# EAGLE design Hardwin01 (EAGLE 7.7.0)
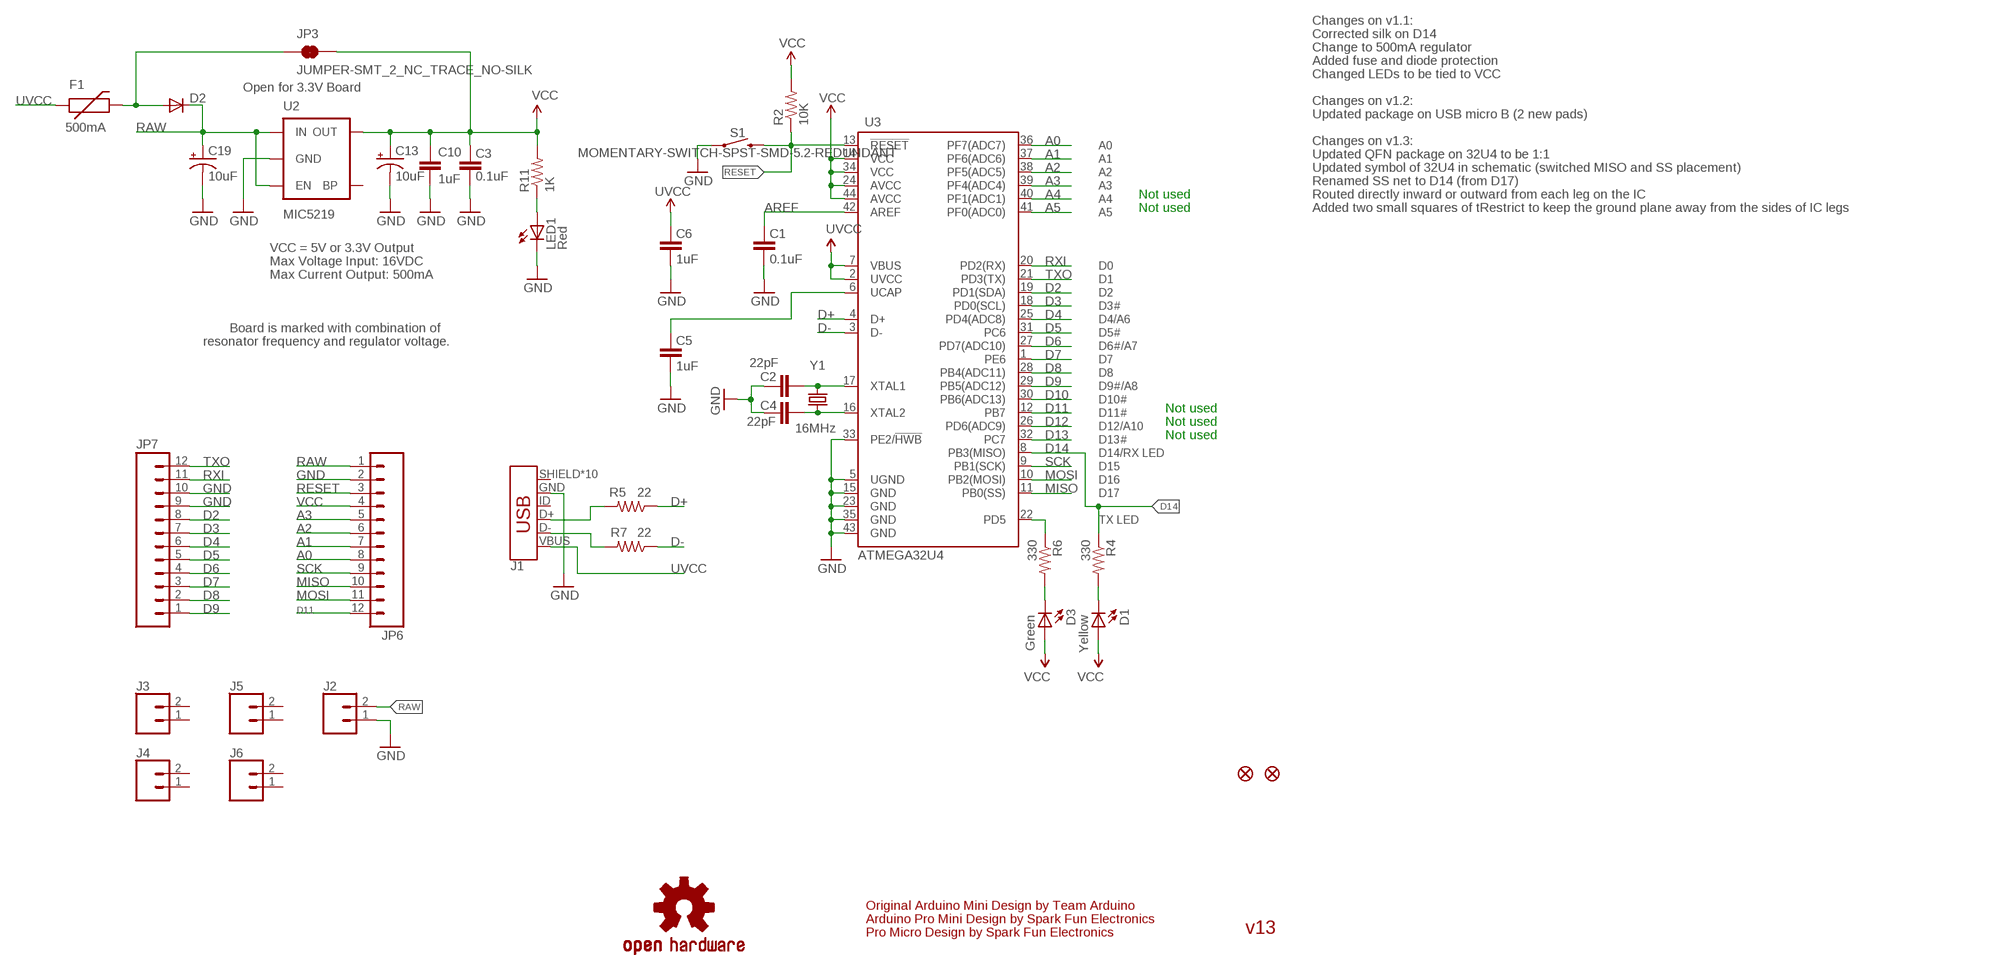
[diagram p0: schematic, sheet 1]

## Parts
C1  0.1uF  CAP0603-CAP  [0603-CAP]
C2  22pF  CAP0603-CAP  [0603-CAP]
C3  0.1uF  CAP0603-CAP  [0603-CAP]
C4  22pF  CAP0603-CAP  [0603-CAP]
C5  1uF  CAP0603-CAP  [0603-CAP]
C6  1uF  CAP0603-CAP  [0603-CAP]
C10  1uF  CAP0603-CAP  [0603-CAP]
C13  10uF  CAP_POL1206  [EIA3216]
C19  10uF  CAP_POL1206  [EIA3216]
D1  Yellow  LED0603  [LED-0603]
D2  DIODESOD  [SOD-323]
D3  Green  LED0603  [LED-0603]
F1  500mA  PTCSMD  [PTC-1206]
J1  USB_MICRO-B_HALF_PTH_MILL  [USB-MICROB-PTH-MILL]
J2  CONN_02PTH3  [1X02_LONGPADS]
J3  CONN_02  [1X02]
J4  CONN_02  [1X02]
J5  CONN_02  [1X02]
J6  CONN_02  [1X02]
JP1  FIDUCIALUFIDUCIAL  [MICRO-FIDUCIAL]
JP2  FIDUCIALUFIDUCIAL  [MICRO-FIDUCIAL]
JP3  JUMPER-SMT_2_NC_TRACE_NO-SILK  [SMT-JUMPER_2_NC_TRACE_NO-SILK]
JP6  M12PTH  [1X12]
JP7  M12PTH  [1X12]
LED1  Red  LED0603  [LED-0603]
R2  10K  RESISTOR0603-RES  [0603-RES]
R4  330  RESISTOR0603-RES  [0603-RES]
R5  22  RESISTOR0603-RES  [0603-RES]
R6  330  RESISTOR0603-RES  [0603-RES]
R7  22  RESISTOR0603-RES  [0603-RES]
R11  1K  RESISTOR0603-RES  [0603-RES]
S1  MOMENTARY-SWITCH-SPST-SMD-5.2-REDUNDANT  [TACTILE_SWITCH_SMD_5.2MM]
U2  MIC5219  V_REG_LDOSMD  [SOT23-5]
U3  ATMEGA32U4  ATMEGA32U4OUTFAKES  [QFN-44-NOPAD_1:1-OUTFAKES]
U$3  OSHW-LOGOS  [OSHW-LOGO-S]
Y1  16MHz  CRYSTAL5X3  [CRYSTAL-SMD-5X3]

## Nets
A0: JP6.8 U3.36(PF7(ADC7))
A1: JP6.7 U3.37(PF6(ADC6))
A2: JP6.6 U3.38(PF5(ADC5))
A3: JP6.5 U3.39(PF4(ADC4))
A4: U3.40(PF1(ADC1))
A5: U3.41(PF0(ADC0))
AREF: C1.2 U3.42(AREF)
D2: JP7.8 U3.19(PD1(SDA))
D3: JP7.7 U3.18(PD0(SCL))
D4: JP7.6 U3.25(PD4(ADC8))
D5: JP7.5 U3.31(PC6)
D6: JP7.4 U3.27(PD7(ADC10))
D7: JP7.3 U3.1(PE6)
D8: JP7.2 U3.28(PB4(ADC11))
D9: JP7.1 U3.29(PB5(ADC12))
D10: U3.30(PB6(ADC13))
D11: JP6.12 U3.12(PB7)
D12: U3.26(PD6(ADC9))
D13: U3.32(PC7)
D14: R4.1 U3.8(PB3(MISO))
D+: R5.1 U3.4(D+)
D-: R7.1 U3.3(D-)
GND [vcc]: C1.1 C2.2 C3.1 C4.2 C5.1 C6.1 C10.2 C13.C(-) C19.C(-) J1.GND J2.1 JP6.2 JP7.9 JP7.10 LED1.C S1.1 S1.2 U2.2(GND) U3.5(UGND) U3.15(GND) U3.23(GND) U3.33(PE2/!HWB) U3.35(GND) U3.43(GND)
MISO: JP6.10 U3.11(PB0(SS))
MOSI: JP6.11 U3.10(PB2(MOSI))
N$1: C4.1 U3.16(XTAL2) Y1.1
N$2: C2.1 U3.17(XTAL1) Y1.3
N$3: D2.2(A) F1.2 JP3.1
N$4: C5.2 U3.6(UCAP)
N$5: D1.C R4.2
N$6: J1.D- R7.2
N$7: D3.C R6.2
N$8: J1.D+ R5.2
N$38: LED1.A R11.1
RAW [vcc]: C19.A(+) D2.1(C) J2.2 JP6.1 U2.1(IN) U2.3(EN)
RESET: JP6.3 R2.1 S1.3 S1.4 U3.13(!RESET)
RXI: JP7.11 U3.20(PD2(RX))
SCK: JP6.9 U3.9(PB1(SCK))
TXLED: R6.1 U3.22(PD5)
TXO: JP7.12 U3.21(PD3(TX))
UVCC: C6.2 F1.1 J1.VBUS U3.2(UVCC) U3.7(VBUS)
VCC: C3.2 C10.1 C13.A(+) D1.A D3.A JP3.2 JP6.4 R2.2 R11.2 U2.5(OUT) U3.14(VCC) U3.24(AVCC) U3.34(VCC) U3.44(AVCC)
Unconnected: J1.ID J1.SHIELD J1.SHIELD2(SHIELD) J1.SHIELD3(SHIELD) J1.SHIELD4(SHIELD) J1.SHIELD5(SHIELD) J1.SHIELD6(SHIELD) J1.SHIELD7(SHIELD) J1.SHIELD8(SHIELD) J1.SHIELD9(SHIELD) J1.SHIELD10(SHIELD) J3.1 J3.2 J4.1 J4.2 J5.1 J5.2 J6.1 J6.2 U2.4(BP)

## Notes on the sheet
- Changes on v1.1:
- Corrected silk on D14
- Change to 500mA regulator
- Added fuse and diode protection
- Changed LEDs to be tied to VCC
- Open for 3.3V Board
- Changes on v1.2:
- Updated package on USB micro B (2 new pads)
- Changes on v1.3:
- Updated QFN package on 32U4 to be 1:1
- Updated symbol of 32U4 in schematic (switched MISO and SS placement)
- Renamed SS net to D14 (from D17)
- Not used | Routed directly inward or outward from each leg on the IC
- Not used | Added two small squares of tRestrict to keep the ground plane away from the sides of IC legs
- VCC = 5V or 3.3V Output
- Max Voltage Input: 16VDC
- Max Current Output: 500mA
- Board is marked with combination of
- resonator frequency and regulator voltage.
- Not used
- Not used
- Not used
- Original Arduino Mini Design by Team Arduino
- Arduino Pro Mini Design by Spark Fun Electronics
- Pro Micro Design by Spark Fun Electronics | v13

## Library data of the parts
C1-C6 C10 = SparkFun:CAP: Capacitor Standard 0603 ceramic capacitor, and 0.1" leaded capacitor.
C13 C19 = SparkFun:CAP_POL: Capacitor Polarized These are standard SMD and PTH capacitors. Normally 10uF, 47uF, and 100uF in electrolytic and tantalum varieties. Always verify the external diameter of the through hole cap, it varies with capacity, voltage, and manufacturer. The EIA devices should be standard.
D1 D3 LED1 = SparkFun:LED: LEDs Standard schematic elements and footprints for 5mm, 3mm, 1206, and 0603 sized LEDs. 5mm - Spark Fun Electronics SKU : COM-00529 (and others)
D2 = SparkFun:DIODE: Diode These are standard reverse protection diodes and small signal diodes. SMA package can handle up to about 1A. SOD-323 can handle about 200mA. What the SOD-323 package when ordering, there are some mfgs out there that are 5-pin packages.
F1 = SparkFun:PTC: Resettable Fuse PTC Resettable Fuse. Spark Fun Electronics SKU : COM-08357
J1 = SparkFun-Connectors:USB_MICRO-B: USB Type Micro-B Connector Male/female and PTH/SMT variants SparkFun Products: SparkFun microB USB Breakout <https://www.sparkfun.com/products/12035> SparkFun USB microB Plug Breakout <https://www.sparkfun.com/products/10031> SparkFun ESP8266 Thing <https://www.sparkfun.com/products/13231>; PROD_ID: CONN-13711
J2-J6 = SparkFun-Connectors:CONN_02: Multi connection point. Often used as Generic Header-pin footprint for 0.1 inch spaced/style header connections On any of the 0.1 inch spaced packages, you can populate with these: Break Away Headers - Straight <https://www.sparkfun.com/products/116> (PRT-00116) Break Away Male Headers - Right Angle <https://www.sparkfun.com/products/553> (PRT-00553) Female Headers <https://www.sparkfun.com/products/115> (PRT-00115) Break Away Headers - Machine Pin <https://www.sparkfun.com/products/117> (PRT-00117) Break Away Female Headers - Swiss Machine Pin <https://www.sparkfun.com/products/743> (PRT-00743) For SCREWTERMINALS and SPRING TERMINALS visit here: Screw Terimnals on SparkFun.com <https://www.sparkfun.com/search/results?term=Screw+Terminals> (5mm/3.5mm/2.54mm spacing) This device is also useful as a general connection point to wire up your design to another part of your project. Our various solder wires solder well into these plated through hole pads. Hook-Up Wire - Assortment (Stranded, 22 AWG) <https://www.sparkfun.com/products/11375> (PRT-11375) Hook-Up Wire - Assortment (Solid Core, 22 AWG) <https://www.sparkfun.com/products/11367> (PRT-11367) View the entire wire category on our website here <https://www.sparkfun.com/categories/141> Special notes: Molex polarized connector foot print use with: PRT-08233 with associated crimp pins and housings. 2.54_SCREWTERM for use with PRT-10571. 3.5mm Screw Terminal footprints for PRT-08084 5mm Screw Terminal footprints for use with PRT-08432
JP1 JP2 = SparkFun:FIDUCIAL: Fiducial Alignment Points Various fiducial points for machine vision alignment.
JP3 = SparkFun-Jumpers:JUMPER-SMT_2_NC_TRACE: Normally closed trace jumper This jumper has a trace between two pads so it's normally closed (NC). Use a razor knife to open the connection. For best results follow the IPC guidelines for cutting traces: Cutout at least 0.063 mm (0.005 in). Remove all loose material to clean up the cut area. Seal the cut with an approved epoxy. Reapply solder to reclose the connection.
JP6 JP7 = SparkFun:M12: Header 12 Standard 12-pin 0.1" header. Use with straight break away headers (SKU : PRT-00116), right angle break away headers (PRT-00553), swiss pins (PRT-00743), machine pins (PRT-00117), and female headers (PRT-00115).
R2 R4-R7 R11 = SparkFun:RESISTOR: Resistor Basic schematic elements and footprints for 0603, 1206, and PTH resistors.
S1 = SparkFun-Switches:MOMENTARY-SWITCH-SPST: Momentary Switch (Pushbutton) - SPST Normally-open (NO) SPST momentary switches (buttons, pushbuttons). Variants PTH-12MM - 12mm square, through-hole Momentary Pushbutton Switch - 12mm Square <https://www.sparkfun.com/products/9190> (COM-09190) PTH-6.0MM, PTH-6.0MM-KIT - 6.0mm square, through-hole Mini Pushbutton Switch <https://www.sparkfun.com/products/97> (COM-00097) KIT package intended for soldering kit's - only one side of pads' copper is exposed. PTH-RIGHT-ANGLE-KIT - Right-angle, through-hole Right Angle Tactile Button <https://www.sparkfun.com/products/10791> - Used on SparkFun BigTime Watch Kit <https://www.sparkfun.com/products/11734> SMD-12MM - 12mm square, surface-mount Tactile Button - SMD (12mm) <https://www.sparkfun.com/products/12993> (COM-12993) Used on SparkFun PicoBoard <https://www.sparkfun.com/products/11888> SMD-4.5MM - 4.5mm Square Trackball Switch Used on SparkFun Blackberry Trackballer Breakout <https://www.sparkfun.com/products/13169> SMD-4.6MMX2.8MM - 4.60mm x 2.80mm, surface mount Used on SparkFun SAMD21 Mini Breakout <https://www.sparkfun.com/products/13664> SMD-5.2MM, SMD-5.2-REDUNDANT - 5.2mm square, surface-mount Mini Pushbutton Switch - SMD <https://www.sparkfun.com/products/8720> (COM-08720) Used on Arduino Pro Mini <https://www.sparkfun.com/products/11114> REDUNDANT package connects both switch circuits together SMD-6.0X3.5MM - 6.0 x 3.5mm, surface mount Momentary Reset Switch SMD <https://www.sparkfun.com/products/8229> (COM-08229) SMD-6.2MM-TALL - 6.2mm square, surface mount Tactile Button - SMD (6mm) <https://www.sparkfun.com/products/12992> Used on SparkFun Digital Sandbox <https://www.sparkfun.com/products/12651> SMD-RIGHT-ANGLE - Right-angle, surface mount Used on SparkFun Block for Intel® Edison - Arduino <https://www.sparkfun.com/products/13036>; PROD_ID: SWCH-08247; SF_SKU: COM-08720
U2 = SparkFun:V_REG_LDO: Voltage Regulator LDO Standard 150mA LDO voltage regulator in SOT-23 layout. Micrel part MIC5205. BP (by-pass) pin is used to lower output noise with 470pF cap.
U3 = Testing:ATMEGA32U4: Atmel 44-pin 8-bit Microcontroller with 32KBytes of ISP Flash and USB Controller
U$3 = SparkFun:OSHW-LOGO: Open Source Hardware Logo This logo indicates the piece of hardware it is found on incorporates a OSHW license and/or adheres to the definition of open source hardware found here: http://freedomdefined.org/OSHW
Y1 = SparkFun:CRYSTAL: Crystals Various standard crystals. Proven footprints. Spark Fun Electronics SKU : COM-00534

## Net classes
0 default: width 0.152 mm

## Board
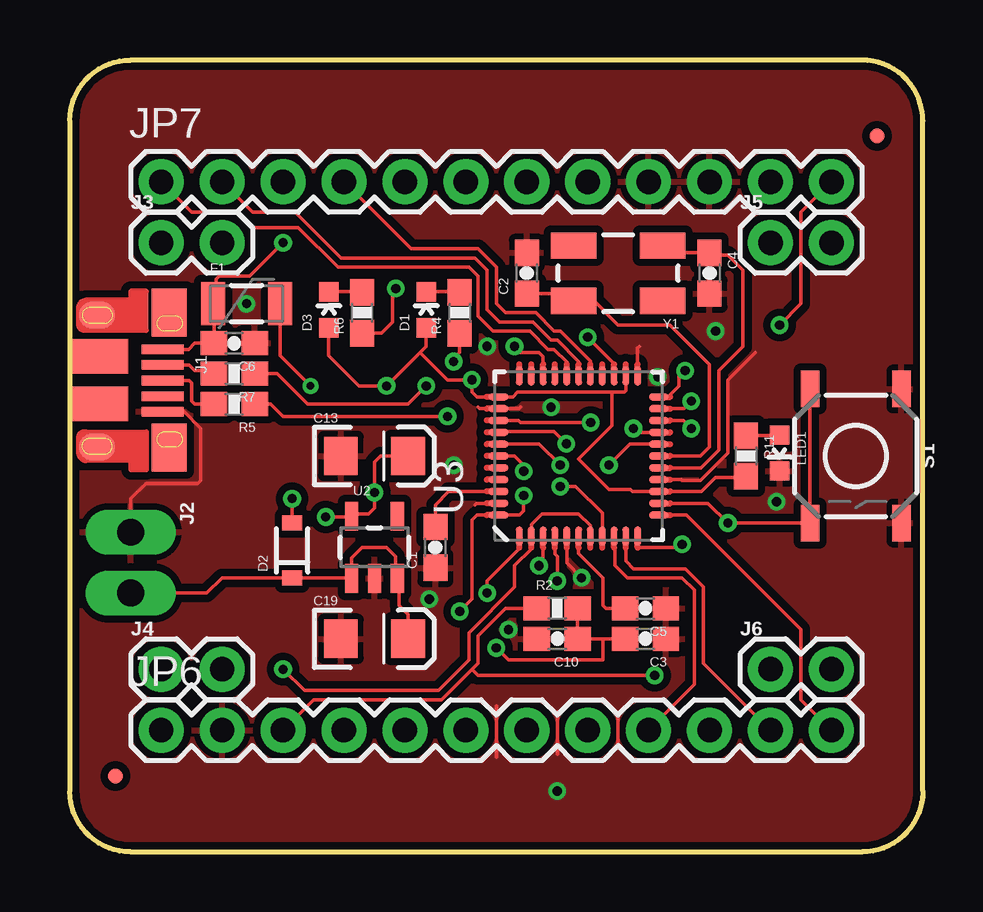
[diagram p1: board, top side]
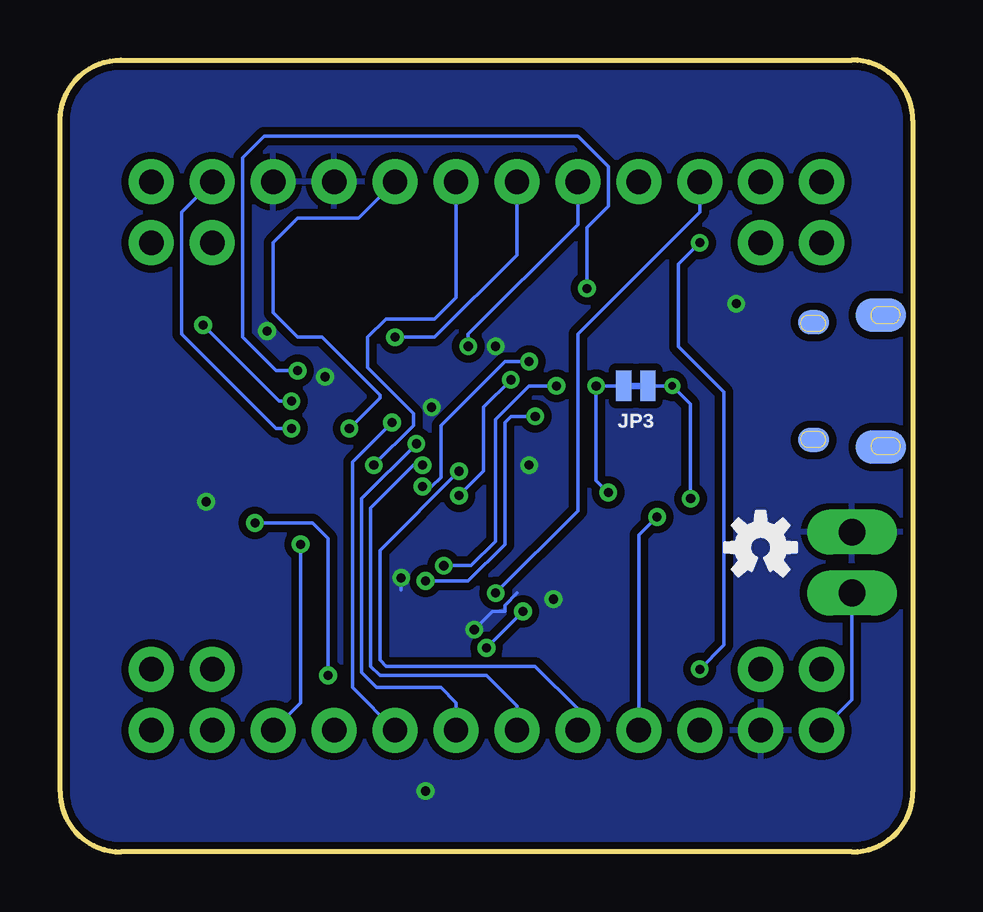
[diagram p2: board, bottom side, seen from below]

Size 35.56 x 33.02 mm. Coordinates in mm from the lower left corner, seen from the top.
Outline: 0,30.48 0,2.54 arc90 2.54,0 33.02,0 arc90 35.56,2.54 35.56,30.48 arc90 33.02,33.02 2.54,33.02 arc90 0,30.48
Copper layers (1*16): Top 0.035mm / dielectric 1.5mm / Bottom 0.035mm
Design rules "SparkFun-2-layer-PCBWay-LIMIT": minimum track width 6mil, minimum drill 0.3mm, track to track 6mil, track to pad 6mil, pad to pad 6mil, via to via 6mil, smd to smd 6mil, copper to edge 6mil, drill to drill 6mil, minimum pad ring 7mil, minimum via ring 7mil, stop-mask expansion 4mil, vias tented up to drill 25mil, thermal gap 10mil

### Footprints (pad centres in the part's own frame; a part is rotated, then mirrored left to right if it is on the bottom)
0603-CAP = smd 1.1 x 1: 1 -0.85,0; 2 0.85,0
EIA3216 = smd 1.4 x 1.6: A 1.4,0; C -1.4,0
LED-0603 = smd 0.8 x 0.8: A 0,-0.75; C 0,0.75
SOD-323 = smd 0.63 x 0.83: 1 -1.15,0; 2 1.15,0
PTC-1206 = smd 1 x 1.8: 1 -1.4,0; 2 1.4,0
USB-MICROB-PTH-MILL = smd 0.4 x 1.75: D+ 0.031,1.331; D- -0.619,1.331; GND 1.331,1.331; ID 0.681,1.331; VBUS -1.269,1.331 | smd 2 x 1.46: SHIELD -2.794,1.606; SHIELD2 2.831,1.606 | smd 1.425 x 2.5: SHIELD3 -0.979,-1.349; SHIELD4 0.996,-1.352 | smd 1.4 x 2.1 bottom: SHIELD5 -2.7,-1.2; SHIELD7 2.8,-1.2 | smd 1.1 x 1.5: SHIELD6 2.8,-1.4; SHIELD8 -2.7,-1.4 | smd 1 x 1.3 bottom: SHIELD9 -2.4,1.6; SHIELD10 2.5,1.6
1X02_LONGPADS = drill 1.118 pad 1.88 long: 1 0,0; 2 2.54,0
1X02 = drill 1.016 pad 1.88: 1 0,0; 2 2.54,0
MICRO-FIDUCIAL = smd 0.635 x 0.635: 1 0,0
SMT-JUMPER_2_NC_TRACE_NO-SILK = smd 0.635 x 1.27: 1 -0.508,0; 2 0.508,0
1X12 = drill 1.016 pad 1.88: 1 0,0; 2 2.54,0; 3 5.08,0; 4 7.62,0; 5 10.16,0; 6 12.7,0; 7 15.24,0; 8 17.78,0; 9 20.32,0; 10 22.86,0; 11 25.4,0; 12 27.94,0
0603-RES = smd 1.1 x 1: 1 -0.85,0; 2 0.85,0
TACTILE_SWITCH_SMD_5.2MM = smd 1.524 x 0.762: 1 -2.794,1.905; 2 2.794,1.905; 3 -2.794,-1.905; 4 2.794,-1.905
SOT23-5 = smd 0.55 x 1.2: 1 -0.95,-1.3; 2 0,-1.3; 3 0.95,-1.3; 4 0.95,1.3; 5 -0.95,1.3
QFN-44-NOPAD_1:1-OUTFAKES = smd 0.8 x 0.3: 1 -3.337,2.465; 2 -3.337,1.972; 3 -3.337,1.479; 4 -3.337,0.986; 5 -3.337,0.493; 6 -3.337,0; 7 -3.337,-0.493; 8 -3.337,-0.986; 9 -3.337,-1.479; 10 -3.337,-1.972; 11 -3.337,-2.465; 23 3.337,-2.465; 24 3.337,-1.972; 25 3.337,-1.479; 26 3.337,-0.986; 27 3.337,-0.493; 28 3.337,0; 29 3.337,0.493; 30 3.337,0.986; 31 3.337,1.479; 32 3.337,1.972; 33 3.337,2.465 | smd 0.3 x 0.8: 12 -2.465,-3.337; 13 -1.972,-3.337; 14 -1.479,-3.337; 15 -0.986,-3.337; 16 -0.493,-3.337; 17 0,-3.337; 18 0.493,-3.337; 19 0.986,-3.337; 20 1.479,-3.337; 21 1.972,-3.337; 22 2.465,-3.337; 34 2.465,3.337; 35 1.972,3.337; 36 1.479,3.337; 37 0.986,3.337; 38 0.493,3.337; 39 0,3.337; 40 -0.493,3.337; 41 -0.986,3.337; 42 -1.479,3.337; 43 -1.972,3.337; 44 -2.465,3.337
CRYSTAL-SMD-5X3 = smd 1.9 x 1.1: 1 -1.85,-1.15; 2 1.85,-1.15; 3 1.85,1.15; 4 -1.85,1.15

### Placement (x,y rotation side)
C1  15.24,12.7 90 top
C2  19.05,24.13 90 top
C3  24,8.89 180 top
C4  26.67,24.13 270 top
C5  24,10.16 180 top
C6  6.86,21.21 180 top
C10  20.32,8.89 180 top
C13  12.7,16.51 0 top
C19  12.7,8.89 0 top
D1  14.86,22.61 0 top
D2  9.27,12.57 90 top
D3  10.79,22.61 0 top
F1  7.37,22.86 0 top
J1  2.54,19.68 270 top
J2  2.54,13.34 270 top
J3  3.81,25.4 0 top
J4  3.81,7.62 0 top
J5  29.21,25.4 0 top
J6  29.21,7.62 0 top
JP1  33.66,29.84 0 top
JP2  1.91,3.17 0 top
JP3  11.56,19.43 180 bottom
JP6  3.81,5.08 0 top
JP7  3.81,27.94 0 top
LED1  29.59,16.64 180 top
R2  20.32,10.16 0 top
R4  16.26,22.48 90 top
R5  6.86,18.67 180 top
R6  12.19,22.48 90 top
R7  6.86,19.94 180 top
R11  28.19,16.51 270 top
S1  32.77,16.51 270 top
U2  12.7,12.7 0 top
U3  21.21,16.51 90 top
U$3  6.35,12.7 0 bottom
Y1  22.86,24.13 180 top

### Tracks (layer width: path | path; a pad name or v marks a point on that pad's centre or on a via)
A0  (via drill 0.38)
  Top 0.152: U3.36 18.71,17.99 18.8,17.91 v21.72,17.91
  Bottom 0.152: JP6.8 23.37,6.86 23.37,16.26 v21.72,17.91
A1  (via drill 0.38)
  Top 0.152: U3.37 17.9,17.53 20.19,17.53 v20.7,17.02
  Bottom 0.152: v20.7,17.02 22.99,14.73 22.99,7.49 22.35,6.86 19.68,6.86 19.05,6.22 JP6.7
A2  (via drill 0.38)
  Top 0.152: 17.38,17 17.39,17.02 19.56,17.02 v20.45,16.13
  Bottom 0.152: JP6.6 16.51,6.1 17.78,7.37 22.23,7.37 22.61,7.75 22.61,14.35 20.83,16.13 v20.45,16.13
A3  (via drill 0.38)
  Top 0.152: 17.38,16.51 18.54,16.51 18.92,16.13 v18.92,15.88
  Bottom 0.152: v18.92,15.88 22.23,12.57 22.23,8 21.97,7.75 15.75,7.75 13.97,5.97 JP6.5
AREF
  Top 0.152: C1.2 15.24,14.48 15.79,15.03 17.38,15.03
D2  (via drill 0.38)
  Top 0.152: U3.19 23.65,17.5 v23.5,17.65
  Bottom 0.152: v23.5,17.65 22.23,18.92 22.23,19.05 24.64,21.46 25.65,21.46 26.67,22.48 26.67,25.4 25.65,26.42 23.11,26.42 JP7.8
D3  (via drill 0.38)
  Top 0.152: U3.18 23.35,17 v22.48,16.13
  Bottom 0.152: v22.48,16.13 20.83,17.78 20.83,18.29 22.73,20.19 22.73,21.46 21.97,22.23 19.94,22.23 19.05,23.11 JP7.7
D4  (via drill 0.38)
  Top 0.152: 22.69,20.34 22.69,20.36 v21.59,21.46
  Bottom 0.152: v21.59,21.46 19.94,21.46 16.51,24.89 JP7.6
D5  (via drill 0.38)
  Top 0.152: 19.73,20.34 19.73,20.66 19.56,20.83 18.8,20.83 v18.54,21.08
  Bottom 0.152: JP7.5 13.97,26.16 18.54,21.59 v18.54,21.08
D6
  Top 0.152: 21.7,20.34 21.7,20.46 20.45,21.72 20.19,21.72 19.43,22.48 18.16,22.48 17.78,22.86 17.78,24.38 17.02,25.15 14.22,25.15 JP7.4
D7  (via drill 0.38)
  Top 0.152: U3.1 18.74,12.65 17.4,11.3 v17.4,10.79
  Bottom 0.152: v17.4,10.79 13.97,14.22 13.97,21.59 8.89,26.67 JP7.3
D8
  Top 0.152: 21.21,20.34 21.21,20.45 20.32,21.34 20.07,21.34 19.3,22.1 17.91,22.1 17.4,22.61 17.4,24.26 16.89,24.77 11.3,24.77 9.4,26.67 7.62,26.67 JP7.2
D9
  Top 0.152: 20.72,20.34 20.72,20.43 20.19,20.95 19.94,20.95 19.18,21.72 17.65,21.72 17.02,22.35 17.02,24 16.64,24.38 11.18,24.38 9.53,26.04 7.62,26.04 6.99,26.67 5.08,26.67 JP7.1
D11
  Top 0.152: 25.04,14.04 25.71,14.04 30.48,9.27 30.48,6.35 JP6.12
D14  (via drill 0.38)
  Top 0.152: v20.45,15.24 21.08,15.24 22.2,14.13 U3.8 | v16,20.45 16,20.57 16.26,20.83 R4.1
  Bottom 0.152: v20.45,15.24 20.07,15.24 19.68,15.62 19.68,17.78 17.02,20.45 v16,20.45
D+  (via drill 0.38)
  Top 0.152: v15.75,18.16 8.89,18.16 8.38,18.67 R5.1 | U3.4 20.22,12.42 20.32,12.32 v20.32,11.3
  Bottom 0.152: v15.75,18.16 16.76,18.16 17.02,17.91 17.02,12.83 18.54,11.3 v20.32,11.3
D-  (via drill 0.38)
  Top 0.152: v14.86,19.43 14.1,18.67 9.91,18.67 8.64,19.94 R7.1 | U3.3 19.73,12.11 v19.56,11.94
  Bottom 0.152: v14.86,19.43 16,19.43 17.4,18.03 17.4,12.95 18.41,11.94 v19.56,11.94
GND  (via drill 0.38)
  Top 0.152: 25.04,15.52 25.5,15.52 25.53,15.49 26.29,15.49 27.43,16.64 27.43,19.68 28.57,20.83 | 17.38,14.54 16.95,14.54 16.89,14.48 | 17.02,18.54 17.08,18.48 U3.35 18.74,18.48 18.8,18.54 | 23.67,20.34 23.67,21.01 23.75,21.08 | 17.78,6.1 17.78,3.94 | 20.32,5.84 20.32,4.06 | 22.86,5.71 22.86,4.32 | U3.5 20.72,12.05 v21.34,11.43 | 18.8,19.79 U3.33 | J1.GND 4.76,18.35 5.46,17.65 5.46,15.49 5.33,15.37 3.17,15.37 2.54,14.73 J2.1
  Bottom 0.152: v21.34,11.43 21.34,10.92 | 16.51,10.79 17.02,10.29 17.02,10.03 17.53,10.03 v18.29,9.27
  other vias: 29.46,14.61 26.92,21.72 16,16.13 20.32,2.54 17.4,21.08 24.51,19.81 14.99,10.54 20.07,18.54 7.37,22.86
  pour Bottom (isolate 0.305): 2.54,33.02 33.02,33.02 arc-90 35.56,30.48 35.56,2.54 arc-90 33.02,0 2.54,0 arc-90 0,2.54 0,30.48 arc-90
  pour Top (isolate 0.305): 2.54,33.02 33.02,33.02 arc-90 35.56,30.48 35.56,2.54 arc-90 33.02,0 2.54,0 arc-90 0,2.54 0,30.48 arc-90
MISO  (via drill 0.38)
  Top 0.152: 23.67,12.7 25.4,12.7 v25.53,12.83
  Bottom 0.152: v25.53,12.83 25.53,6.22 JP6.10
MOSI
  Top 0.152: 23.18,12.7 23.18,12.12 23.5,11.81 25.65,11.81 26.42,11.05 26.42,7.87 JP6.11
N$1
  Top 0.152: Y1.1 25.01,24.98 C4.1 26.76,24.89 27.43,24.89 28.07,24.26 28.07,21.08 27.05,20.07 27.05,16.76 26.3,16.02 U3.16
N$2
  Top 0.152: C2.1 20.71,23.28 Y1.3 21.85,22.98 22.86,21.97 25.02,21.97 26.67,20.32 26.67,16.89 26.29,16.51 25.04,16.51
N$3  (via drill 0.31, 0.38)
  Top 0.152: F1.2 8.77,20.7 v10.03,19.43 | D2.2 v9.27,14.73
  Bottom 0.152: JP3.1 v10.03,19.43 9.27,18.67 v9.27,14.73
N$4
  Top 0.152: 21.21,12.7 21.21,12.45 22.23,11.43 22.23,10.29 22.35,10.16 C5.2
N$5
  Top 0.152: D1.C 16.23,23.36 R4.2
N$6
  Top 0.152: J1.D- 4.97,20.3 5.21,20.07 5.88,20.07 R7.2
N$7
  Top 0.152: D3.C 12.16,23.36 R6.2
N$8
  Top 0.152: J1.D+ 4.98,19.65 5.08,19.56 5.08,18.8 5.21,18.67 R5.2
N$38
  Top 0.152: R11.1 29.56,17.36 LED1.A
RAW
  Top 0.152: C19.A 14.1,9.9 13.72,10.29 13.72,11.33 U2.3 13.59,11.46 13.59,12.32 13.21,12.7 12.19,12.7 11.75,12.26 U2.1 11.73,11.42 D2.1 6.35,11.43 5.71,10.79 J2.2
  Bottom 0.152: J2.2 2.54,6.35 JP6.1
RESET  (via drill 0.38)
  Top 0.152: S1.3 S1.4 v27.43,13.72 26.61,14.54 U3.13 | JP6.3 10.16,6.35 15.49,6.35 16.76,7.62 | R2.1 18.16,10.16 17.02,9.02 17.02,7.87 16.76,7.62 | v24.38,7.37 17.02,7.37 16.76,7.62
  Bottom 0.152: v27.43,13.72 25.02,13.72 24.38,13.08 v24.38,7.37
RXI  (via drill 0.38)
  Top 0.152: 25.04,17.99 25.57,17.99 v25.91,17.65
  Bottom 0.152: v25.91,17.65 26.54,17.65 30.48,21.59 30.48,26.67 JP7.11
SCK
  Top 0.152: JP6.9 26.04,6.99 26.04,10.92 25.53,11.43 23.24,11.43 22.73,11.94 22.73,13.13 U3.9
TXLED  (via drill 0.38)
  Top 0.152: R6.1 12.99,21.63 13.46,22.1 13.46,23.37 v13.59,23.5 | 25.04,18.98 25.04,19.07 25.4,19.43 25.4,19.81 v25.65,20.07
  Bottom 0.152: v13.59,23.5 13.59,26.04 12.7,26.92 12.7,28.57 13.97,29.84 27.05,29.84 27.94,28.96 27.94,21.46 26.54,20.07 v25.65,20.07
TXO  (via drill 0.38)
  Top 0.152: 25.04,18.48 25.59,18.48 v25.91,18.8 | v29.59,21.97 30.48,22.86 30.48,26.67 JP7.12
  Bottom 0.152: v25.91,18.8 26.42,18.8 v29.59,21.97
UVCC  (via drill 0.38)
  Top 0.152: v8.89,7.62 9.78,6.73 15.37,6.73 16.64,8 16.64,9.14 18.54,11.05 18.54,11.94 19.24,12.63 19.24,12.7 | U3.7 21.7,13.6 21.21,14.1 19.68,14.1 19.24,13.65 U3.2 | v8.89,25.4 7.49,24 6.22,24 6.1,23.88 6.1,22.99 F1.1 6.01,22.82 C6.2 5.21,21.21 4.95,20.95 J1.VBUS
  Bottom 0.152: v8.89,7.62 7.87,8.64 7.87,19.18 9.78,21.08 9.78,24.51 v8.89,25.4
VCC  (via drill 0.38)
  Top 0.152: D1.A 14.86,21.08 14.61,20.83 | 14.61,20.83 v13.21,19.43 JP3.2 10.79,20.7 D3.A | C3.2 22.23,8.89 | 22.23,8.89 C10.1 R2.2 | 25.04,15.03 26.33,15.03 26.92,15.62 28.16,15.62 R11.2 | C13.A 12.95,16.51 12.7,16.26 v12.7,14.99 12.7,14.35 12.45,14.1 11.85,14.1 U2.5 11.72,13.97 v10.67,13.97 | 22.23,8.89 22.23,8 18.29,8 v17.78,8.51 | v16.26,10.03 16.76,10.54 16.76,13.84 16.97,14.04 17.38,14.04 18.74,14.04 18.92,14.22 v18.92,14.86 | U3.24 23.18,19.24 23.11,19.18 22.61,19.18 | U3.34 18.47,18.98 18.67,19.18 22.61,19.18 | 22.61,19.18 22.61,17.78 21.21,16.38 22.48,15.11 23.37,15.11 23.45,15.03 U3.14 | 17.38,18.98 16.97,18.98 16.76,19.18 v16.76,19.68 15.75,19.68 14.61,20.83
  Bottom 0.152: JP3.2 v13.21,19.43 13.21,15.49 v12.7,14.99 | JP6.4 11.43,13.21 v10.67,13.97 | v17.78,8.51 v16.26,10.03 | v18.92,14.86 17.91,15.88 17.91,18.54 v16.76,19.68